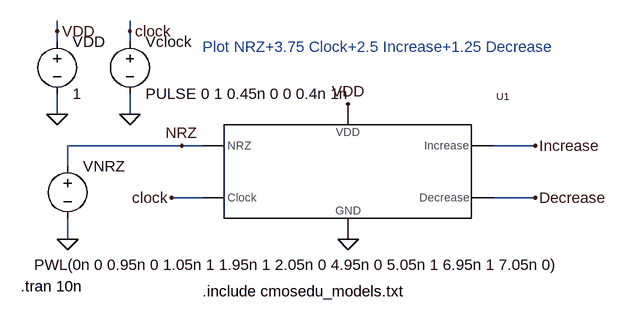
[diagram p0: schematic Fig19_72.asc]
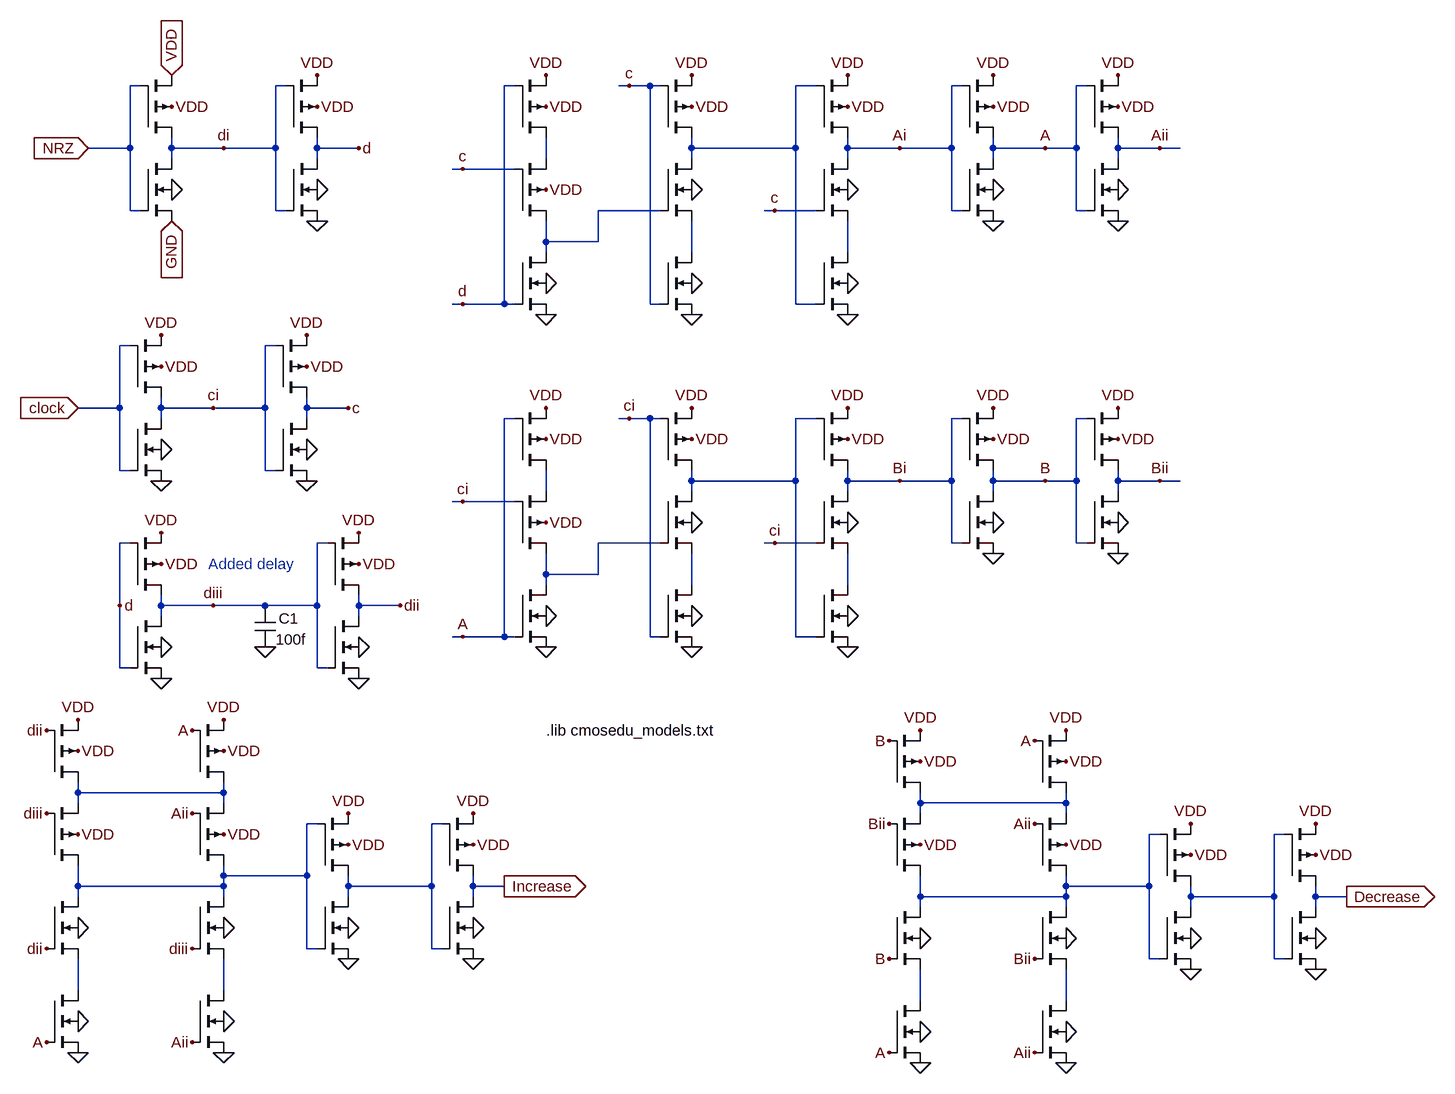
[diagram p1: sub-circuit hogge_pd.asc]
Fig19_72.asc, the LTspice schematic file:
Version 4
SHEET 1 6288 680
WIRE 1168 -1104 1168 -1120
WIRE 1280 -1104 1280 -1120
WIRE 1168 -1088 1168 -1104
WIRE 1280 -1088 1280 -1104
WIRE 1168 -976 1168 -1008
WIRE 1280 -976 1280 -1008
WIRE 1360 -928 1184 -928
WIRE 1392 -928 1360 -928
WIRE 1904 -928 1840 -928
WIRE 1184 -896 1184 -928
WIRE 1392 -848 1344 -848
WIRE 1904 -848 1840 -848
WIRE 1184 -784 1184 -816
FLAG 1168 -976 0
FLAG 1168 -1104 VDD
FLAG 1616 -784 0
FLAG 1616 -992 VDD
FLAG 1344 -848 clock
FLAG 1360 -928 NRZ
FLAG 1904 -928 Increase
FLAG 1904 -848 Decrease
FLAG 1184 -784 0
FLAG 1280 -976 0
FLAG 1280 -1104 clock
SYMBOL voltage 1168 -1104 R0
WINDOW 123 0 0 Left 0
WINDOW 39 0 0 Left 0
SYMATTR InstName VDD
SYMATTR Value 1
SYMBOL voltage 1184 -912 R0
WINDOW 123 0 0 Left 0
WINDOW 39 0 0 Left 0
WINDOW 3 -51 167 Left 0
SYMATTR Value PWL(0n 0 0.95n 0 1.05n 1 1.95n 1 2.05n 0 4.95n 0 5.05n 1 6.95n 1 7.05n 0)
SYMATTR InstName VNRZ
SYMBOL voltage 1280 -1104 R0
WINDOW 123 0 0 Left 0
WINDOW 39 0 0 Left 0
SYMATTR InstName Vclock
SYMATTR Value PULSE 0 1 0.45n 0 0 0.4n 1n
SYMBOL Hogge_PD 1424 -880 R0
SYMATTR InstName U1
TEXT 1112 -712 Left 0 !.tran 10n
TEXT 1392 -1080 Left 0 ;Plot NRZ+3.75 Clock+2.5 Increase+1.25 Decrease
TEXT 1392 -704 Left 0 !.include cmosedu_models.txt

hogge_pd.asc, the sub-circuit schematic file:
Version 4
SHEET 1 6288 1628
WIRE 336 544 336 528
WIRE 336 560 336 544
WIRE 336 688 336 656
WIRE 336 704 336 688
WIRE 336 848 336 800
WIRE 400 -48 336 -48
WIRE 400 -48 400 -144
WIRE 400 48 400 -48
WIRE 400 256 400 160
WIRE 400 352 400 256
WIRE 416 -448 352 -448
WIRE 416 -448 416 -544
WIRE 416 -352 416 -448
WIRE 416 -144 400 -144
WIRE 416 48 400 48
WIRE 416 160 400 160
WIRE 416 352 400 352
WIRE 432 -544 416 -544
WIRE 432 -352 416 -352
WIRE 464 -48 464 -64
WIRE 464 -32 464 -48
WIRE 464 256 464 240
WIRE 464 272 464 256
WIRE 480 -448 480 -464
WIRE 480 -432 480 -448
WIRE 544 -48 464 -48
WIRE 544 256 464 256
WIRE 560 -448 480 -448
WIRE 560 544 336 544
WIRE 560 544 560 528
WIRE 560 560 560 544
WIRE 560 672 560 656
WIRE 560 688 336 688
WIRE 560 688 560 672
WIRE 560 704 560 688
WIRE 560 848 560 800
WIRE 624 -48 544 -48
WIRE 624 -48 624 -144
WIRE 624 48 624 -48
WIRE 624 256 544 256
WIRE 640 -448 560 -448
WIRE 640 -448 640 -544
WIRE 640 -352 640 -448
WIRE 640 -144 624 -144
WIRE 640 48 624 48
WIRE 656 -544 640 -544
WIRE 656 -352 640 -352
WIRE 688 -48 688 -64
WIRE 688 -32 688 -48
WIRE 688 672 560 672
WIRE 688 672 688 592
WIRE 688 784 688 672
WIRE 704 -448 704 -464
WIRE 704 -432 704 -448
WIRE 704 256 624 256
WIRE 704 256 704 160
WIRE 704 352 704 256
WIRE 704 592 688 592
WIRE 704 784 688 784
WIRE 720 160 704 160
WIRE 720 352 704 352
WIRE 752 -48 688 -48
WIRE 752 688 752 672
WIRE 752 704 752 688
WIRE 768 -448 704 -448
WIRE 768 256 768 240
WIRE 768 272 768 256
WIRE 832 256 768 256
WIRE 880 688 752 688
WIRE 880 688 880 592
WIRE 880 784 880 688
WIRE 896 592 880 592
WIRE 896 784 880 784
WIRE 928 -416 912 -416
WIRE 928 -208 912 -208
WIRE 928 96 912 96
WIRE 928 304 912 304
WIRE 944 688 944 672
WIRE 944 704 944 688
WIRE 992 -208 928 -208
WIRE 992 -208 992 -544
WIRE 992 304 928 304
WIRE 992 304 992 -32
WIRE 992 688 944 688
WIRE 1008 -544 992 -544
WIRE 1008 -416 928 -416
WIRE 1008 -208 992 -208
WIRE 1008 -32 992 -32
WIRE 1008 96 928 96
WIRE 1008 304 992 304
WIRE 1056 -432 1056 -464
WIRE 1056 -304 1056 -336
WIRE 1056 -288 1056 -304
WIRE 1056 80 1056 48
WIRE 1056 208 1056 176
WIRE 1056 224 1056 208
WIRE 1136 -304 1056 -304
WIRE 1136 -304 1136 -352
WIRE 1136 208 1056 208
WIRE 1136 208 1136 160
WIRE 1184 -544 1168 -544
WIRE 1184 -32 1168 -32
WIRE 1216 -544 1184 -544
WIRE 1216 -208 1216 -544
WIRE 1216 -32 1184 -32
WIRE 1216 304 1216 -32
WIRE 1232 -544 1216 -544
WIRE 1232 -352 1136 -352
WIRE 1232 -208 1216 -208
WIRE 1232 -32 1216 -32
WIRE 1232 160 1136 160
WIRE 1232 304 1216 304
WIRE 1280 -448 1280 -464
WIRE 1280 -432 1280 -448
WIRE 1280 -288 1280 -336
WIRE 1280 64 1280 48
WIRE 1280 80 1280 64
WIRE 1280 224 1280 176
WIRE 1408 -352 1392 -352
WIRE 1408 160 1392 160
WIRE 1440 -448 1280 -448
WIRE 1440 -448 1440 -544
WIRE 1440 -208 1440 -448
WIRE 1440 64 1280 64
WIRE 1440 64 1440 -32
WIRE 1440 304 1440 64
WIRE 1472 -544 1440 -544
WIRE 1472 -352 1408 -352
WIRE 1472 -208 1440 -208
WIRE 1472 -32 1440 -32
WIRE 1472 160 1408 160
WIRE 1472 304 1440 304
WIRE 1520 -448 1520 -464
WIRE 1520 -432 1520 -448
WIRE 1520 -288 1520 -336
WIRE 1520 64 1520 48
WIRE 1520 80 1520 64
WIRE 1520 224 1520 176
WIRE 1600 -448 1520 -448
WIRE 1600 64 1520 64
WIRE 1632 560 1632 544
WIRE 1632 576 1632 560
WIRE 1632 704 1632 672
WIRE 1632 720 1632 704
WIRE 1632 864 1632 816
WIRE 1680 -448 1600 -448
WIRE 1680 -448 1680 -544
WIRE 1680 -352 1680 -448
WIRE 1680 64 1600 64
WIRE 1680 64 1680 -32
WIRE 1680 160 1680 64
WIRE 1696 -544 1680 -544
WIRE 1696 -352 1680 -352
WIRE 1696 -32 1680 -32
WIRE 1696 160 1680 160
WIRE 1744 -448 1744 -464
WIRE 1744 -432 1744 -448
WIRE 1744 64 1744 48
WIRE 1744 80 1744 64
WIRE 1824 -448 1744 -448
WIRE 1824 64 1744 64
WIRE 1856 560 1632 560
WIRE 1856 560 1856 544
WIRE 1856 576 1856 560
WIRE 1856 688 1856 672
WIRE 1856 704 1632 704
WIRE 1856 704 1856 688
WIRE 1856 720 1856 704
WIRE 1856 864 1856 816
WIRE 1872 -448 1824 -448
WIRE 1872 -448 1872 -544
WIRE 1872 -352 1872 -448
WIRE 1872 64 1824 64
WIRE 1872 64 1872 -32
WIRE 1872 160 1872 64
WIRE 1888 -544 1872 -544
WIRE 1888 -352 1872 -352
WIRE 1888 -32 1872 -32
WIRE 1888 160 1872 160
WIRE 1936 -448 1936 -464
WIRE 1936 -432 1936 -448
WIRE 1936 64 1936 48
WIRE 1936 80 1936 64
WIRE 1984 688 1856 688
WIRE 1984 688 1984 608
WIRE 1984 800 1984 688
WIRE 2000 -448 1936 -448
WIRE 2000 64 1936 64
WIRE 2000 608 1984 608
WIRE 2000 800 1984 800
WIRE 2032 -448 2000 -448
WIRE 2032 64 2000 64
WIRE 2048 704 2048 688
WIRE 2048 720 2048 704
WIRE 2176 704 2048 704
WIRE 2176 704 2176 608
WIRE 2176 800 2176 704
WIRE 2192 608 2176 608
WIRE 2192 800 2176 800
WIRE 2240 704 2240 688
WIRE 2240 720 2240 704
WIRE 2288 704 2240 704
FLAG 480 -512 VDD
FLAG 1280 -384 0
FLAG 704 -512 VDD
FLAG 1056 -512 VDD
FLAG 1280 -512 VDD
FLAG 1520 -512 VDD
FLAG 1744 -512 VDD
FLAG 1936 -512 VDD
FLAG 1056 -384 VDD
FLAG 480 -384 0
FLAG 704 -384 0
FLAG 1520 -384 0
FLAG 1744 -384 0
FLAG 1936 -384 0
FLAG 1056 -240 0
FLAG 1280 -240 0
FLAG 1520 -240 0
FLAG 1632 496 VDD
FLAG 1856 496 VDD
FLAG 1632 624 VDD
FLAG 1856 624 VDD
FLAG 1632 768 0
FLAG 1856 768 0
FLAG 1632 912 0
FLAG 1856 912 0
FLAG 2048 640 VDD
FLAG 2240 640 VDD
FLAG 2048 768 0
FLAG 2240 768 0
FLAG 480 -560 VDD
IOPIN 480 -560 In
FLAG 480 -336 GND
IOPIN 480 -336 In
FLAG 352 -448 NRZ
IOPIN 352 -448 In
FLAG 704 -336 0
FLAG 704 -560 VDD
FLAG 1056 -560 VDD
FLAG 1280 -560 VDD
FLAG 1520 -560 VDD
FLAG 1744 -560 VDD
FLAG 1936 -560 VDD
FLAG 2240 592 VDD
FLAG 2048 592 VDD
FLAG 1856 448 VDD
FLAG 1632 448 VDD
FLAG 560 -448 di
FLAG 768 -448 d
FLAG 1056 -192 0
FLAG 1280 -192 0
FLAG 1520 -192 0
FLAG 1936 -336 0
FLAG 1744 -336 0
FLAG 2240 816 0
FLAG 2048 816 0
FLAG 1856 960 0
FLAG 1632 960 0
FLAG 2288 704 Decrease
IOPIN 2288 704 Out
FLAG 928 -416 c
FLAG 1184 -544 c
FLAG 1408 -352 c
FLAG 928 -208 d
FLAG 1600 -448 Ai
FLAG 1824 -448 A
FLAG 2000 -448 Aii
FLAG 1584 464 B
FLAG 1584 800 B
FLAG 1584 592 Bii
FLAG 1584 944 A
FLAG 1808 944 Aii
FLAG 1808 800 Bii
FLAG 1808 592 Aii
FLAG 1808 464 A
FLAG 464 -112 VDD
FLAG 1280 128 0
FLAG 688 -112 VDD
FLAG 1056 0 VDD
FLAG 1280 0 VDD
FLAG 1520 0 VDD
FLAG 1744 0 VDD
FLAG 1936 0 VDD
FLAG 1056 128 VDD
FLAG 464 16 0
FLAG 688 16 0
FLAG 1520 128 0
FLAG 1744 128 0
FLAG 1936 128 0
FLAG 1056 272 0
FLAG 1280 272 0
FLAG 1520 272 0
FLAG 336 480 VDD
FLAG 560 480 VDD
FLAG 336 608 VDD
FLAG 560 608 VDD
FLAG 336 752 0
FLAG 560 752 0
FLAG 336 896 0
FLAG 560 896 0
FLAG 752 624 VDD
FLAG 944 624 VDD
FLAG 752 752 0
FLAG 944 752 0
FLAG 336 -48 clock
IOPIN 336 -48 In
FLAG 688 64 0
FLAG 688 -160 VDD
FLAG 1056 -48 VDD
FLAG 1280 -48 VDD
FLAG 1520 -48 VDD
FLAG 1744 -48 VDD
FLAG 1936 -48 VDD
FLAG 944 576 VDD
FLAG 752 576 VDD
FLAG 560 432 VDD
FLAG 336 432 VDD
FLAG 544 -48 ci
FLAG 752 -48 c
FLAG 1056 320 0
FLAG 1280 320 0
FLAG 1520 320 0
FLAG 1936 176 0
FLAG 1744 176 0
FLAG 944 800 0
FLAG 752 800 0
FLAG 560 944 0
FLAG 336 944 0
FLAG 992 688 Increase
IOPIN 992 688 Out
FLAG 928 96 ci
FLAG 1184 -32 ci
FLAG 1408 160 ci
FLAG 928 304 A
FLAG 1600 64 Bi
FLAG 1824 64 B
FLAG 2000 64 Bii
FLAG 288 448 dii
FLAG 288 784 dii
FLAG 288 576 diii
FLAG 288 928 A
FLAG 512 928 Aii
FLAG 512 784 diii
FLAG 512 576 Aii
FLAG 512 448 A
FLAG 464 64 0
FLAG 464 -160 VDD
FLAG 464 192 VDD
FLAG 768 192 VDD
FLAG 464 320 0
FLAG 768 320 0
FLAG 768 368 0
FLAG 768 144 VDD
FLAG 544 256 diii
FLAG 832 256 dii
FLAG 464 368 0
FLAG 464 144 VDD
FLAG 400 256 d
FLAG 624 320 0
SYMBOL pmos4 432 -464 M180
WINDOW 0 88 9 Invisible 0
WINDOW 3 168 20 Invisible 0
SYMATTR InstName M3
SYMATTR Value P_50n
SYMATTR Value2 l=50n w=1u
SYMBOL nmos4 1232 -432 R0
WINDOW 0 104 24 Invisible 0
WINDOW 3 179 41 Invisible 0
SYMATTR InstName M7
SYMATTR Value N_50n
SYMATTR Value2 l=50n w=500n
SYMBOL pmos4 656 -464 M180
WINDOW 0 88 9 Invisible 0
WINDOW 3 168 20 Invisible 0
SYMATTR InstName M1
SYMATTR Value P_50n
SYMATTR Value2 l=50n w=1u
SYMBOL pmos4 1008 -464 M180
WINDOW 0 88 9 Invisible 0
WINDOW 3 168 20 Invisible 0
SYMATTR InstName M2
SYMATTR Value P_50n
SYMATTR Value2 l=50n w=1u
SYMBOL pmos4 1232 -464 M180
WINDOW 0 88 9 Invisible 0
WINDOW 3 168 20 Invisible 0
SYMATTR InstName M4
SYMATTR Value P_50n
SYMATTR Value2 l=50n w=1u
SYMBOL pmos4 1472 -464 M180
WINDOW 0 88 9 Invisible 0
WINDOW 3 168 20 Invisible 0
SYMATTR InstName M5
SYMATTR Value P_50n
SYMATTR Value2 l=50n w=1u
SYMBOL pmos4 1696 -464 M180
WINDOW 0 88 9 Invisible 0
WINDOW 3 168 20 Invisible 0
SYMATTR InstName M6
SYMATTR Value P_50n
SYMATTR Value2 l=50n w=1u
SYMBOL pmos4 1888 -464 M180
WINDOW 0 88 9 Invisible 0
WINDOW 3 168 20 Invisible 0
SYMATTR InstName M8
SYMATTR Value P_50n
SYMATTR Value2 l=50n w=1u
SYMBOL pmos4 1008 -336 M180
WINDOW 0 88 9 Invisible 0
WINDOW 3 168 20 Invisible 0
SYMATTR InstName M9
SYMATTR Value P_50n
SYMATTR Value2 l=50n w=1u
SYMBOL nmos4 432 -432 R0
WINDOW 0 104 24 Invisible 0
WINDOW 3 179 41 Invisible 0
SYMATTR InstName M10
SYMATTR Value N_50n
SYMATTR Value2 l=50n w=500n
SYMBOL nmos4 656 -432 R0
WINDOW 0 104 24 Invisible 0
WINDOW 3 179 41 Invisible 0
SYMATTR InstName M11
SYMATTR Value N_50n
SYMATTR Value2 l=50n w=500n
SYMBOL nmos4 1472 -432 R0
WINDOW 0 104 24 Invisible 0
WINDOW 3 179 41 Invisible 0
SYMATTR InstName M12
SYMATTR Value N_50n
SYMATTR Value2 l=50n w=500n
SYMBOL nmos4 1696 -432 R0
WINDOW 0 104 24 Invisible 0
WINDOW 3 179 41 Invisible 0
SYMATTR InstName M13
SYMATTR Value N_50n
SYMATTR Value2 l=50n w=500n
SYMBOL nmos4 1888 -432 R0
WINDOW 0 104 24 Invisible 0
WINDOW 3 179 41 Invisible 0
SYMATTR InstName M14
SYMATTR Value N_50n
SYMATTR Value2 l=50n w=500n
SYMBOL nmos4 1008 -288 R0
WINDOW 0 104 24 Invisible 0
WINDOW 3 179 41 Invisible 0
SYMATTR InstName M15
SYMATTR Value N_50n
SYMATTR Value2 l=50n w=500n
SYMBOL nmos4 1232 -288 R0
WINDOW 0 104 24 Invisible 0
WINDOW 3 179 41 Invisible 0
SYMATTR InstName M16
SYMATTR Value N_50n
SYMATTR Value2 l=50n w=500n
SYMBOL nmos4 1472 -288 R0
WINDOW 0 104 24 Invisible 0
WINDOW 3 179 41 Invisible 0
SYMATTR InstName M17
SYMATTR Value N_50n
SYMATTR Value2 l=50n w=500n
SYMBOL pmos4 1584 544 M180
WINDOW 0 88 9 Invisible 0
WINDOW 3 168 20 Invisible 0
SYMATTR InstName M18
SYMATTR Value P_50n
SYMATTR Value2 l=50n w=1u
SYMBOL pmos4 1808 544 M180
WINDOW 0 88 9 Invisible 0
WINDOW 3 168 20 Invisible 0
SYMATTR InstName M19
SYMATTR Value P_50n
SYMATTR Value2 l=50n w=1u
SYMBOL pmos4 1584 672 M180
WINDOW 0 88 9 Invisible 0
WINDOW 3 168 20 Invisible 0
SYMATTR InstName M20
SYMATTR Value P_50n
SYMATTR Value2 l=50n w=1u
SYMBOL pmos4 1808 672 M180
WINDOW 0 88 9 Invisible 0
WINDOW 3 168 20 Invisible 0
SYMATTR InstName M21
SYMATTR Value P_50n
SYMATTR Value2 l=50n w=1u
SYMBOL nmos4 1584 720 R0
WINDOW 0 104 24 Invisible 0
WINDOW 3 179 41 Invisible 0
SYMATTR InstName M22
SYMATTR Value N_50n
SYMATTR Value2 l=50n w=500n
SYMBOL nmos4 1808 720 R0
WINDOW 0 104 24 Invisible 0
WINDOW 3 179 41 Invisible 0
SYMATTR InstName M23
SYMATTR Value N_50n
SYMATTR Value2 l=50n w=500n
SYMBOL nmos4 1584 864 R0
WINDOW 0 104 24 Invisible 0
WINDOW 3 179 41 Invisible 0
SYMATTR InstName M24
SYMATTR Value N_50n
SYMATTR Value2 l=50n w=500n
SYMBOL nmos4 1808 864 R0
WINDOW 0 104 24 Invisible 0
WINDOW 3 179 41 Invisible 0
SYMATTR InstName M25
SYMATTR Value N_50n
SYMATTR Value2 l=50n w=500n
SYMBOL pmos4 2000 688 M180
WINDOW 0 88 9 Invisible 0
WINDOW 3 168 20 Invisible 0
SYMATTR InstName M26
SYMATTR Value P_50n
SYMATTR Value2 l=50n w=1u
SYMBOL pmos4 2192 688 M180
WINDOW 0 88 9 Invisible 0
WINDOW 3 168 20 Invisible 0
SYMATTR InstName M27
SYMATTR Value P_50n
SYMATTR Value2 l=50n w=1u
SYMBOL nmos4 2000 720 R0
WINDOW 0 104 24 Invisible 0
WINDOW 3 179 41 Invisible 0
SYMATTR InstName M28
SYMATTR Value N_50n
SYMATTR Value2 l=50n w=500n
SYMBOL nmos4 2192 720 R0
WINDOW 0 104 24 Invisible 0
WINDOW 3 179 41 Invisible 0
SYMATTR InstName M29
SYMATTR Value N_50n
SYMATTR Value2 l=50n w=500n
SYMBOL pmos4 416 -64 M180
WINDOW 0 88 9 Invisible 0
WINDOW 3 168 20 Invisible 0
SYMATTR InstName M30
SYMATTR Value P_50n
SYMATTR Value2 l=50n w=1u
SYMBOL nmos4 1232 80 R0
WINDOW 0 104 24 Invisible 0
WINDOW 3 179 41 Invisible 0
SYMATTR InstName M31
SYMATTR Value N_50n
SYMATTR Value2 l=50n w=500n
SYMBOL pmos4 640 -64 M180
WINDOW 0 88 9 Invisible 0
WINDOW 3 168 20 Invisible 0
SYMATTR InstName M32
SYMATTR Value P_50n
SYMATTR Value2 l=50n w=1u
SYMBOL pmos4 1008 48 M180
WINDOW 0 88 9 Invisible 0
WINDOW 3 168 20 Invisible 0
SYMATTR InstName M33
SYMATTR Value P_50n
SYMATTR Value2 l=50n w=1u
SYMBOL pmos4 1232 48 M180
WINDOW 0 88 9 Invisible 0
WINDOW 3 168 20 Invisible 0
SYMATTR InstName M34
SYMATTR Value P_50n
SYMATTR Value2 l=50n w=1u
SYMBOL pmos4 1472 48 M180
WINDOW 0 88 9 Invisible 0
WINDOW 3 168 20 Invisible 0
SYMATTR InstName M35
SYMATTR Value P_50n
SYMATTR Value2 l=50n w=1u
SYMBOL pmos4 1696 48 M180
WINDOW 0 88 9 Invisible 0
WINDOW 3 168 20 Invisible 0
SYMATTR InstName M36
SYMATTR Value P_50n
SYMATTR Value2 l=50n w=1u
SYMBOL pmos4 1888 48 M180
WINDOW 0 88 9 Invisible 0
WINDOW 3 168 20 Invisible 0
SYMATTR InstName M37
SYMATTR Value P_50n
SYMATTR Value2 l=50n w=1u
SYMBOL pmos4 1008 176 M180
WINDOW 0 88 9 Invisible 0
WINDOW 3 168 20 Invisible 0
SYMATTR InstName M38
SYMATTR Value P_50n
SYMATTR Value2 l=50n w=1u
SYMBOL nmos4 416 -32 R0
WINDOW 0 104 24 Invisible 0
WINDOW 3 179 41 Invisible 0
SYMATTR InstName M39
SYMATTR Value N_50n
SYMATTR Value2 l=50n w=500n
SYMBOL nmos4 640 -32 R0
WINDOW 0 104 24 Invisible 0
WINDOW 3 179 41 Invisible 0
SYMATTR InstName M40
SYMATTR Value N_50n
SYMATTR Value2 l=50n w=500n
SYMBOL nmos4 1472 80 R0
WINDOW 0 104 24 Invisible 0
WINDOW 3 179 41 Invisible 0
SYMATTR InstName M41
SYMATTR Value N_50n
SYMATTR Value2 l=50n w=500n
SYMBOL nmos4 1696 80 R0
WINDOW 0 104 24 Invisible 0
WINDOW 3 179 41 Invisible 0
SYMATTR InstName M42
SYMATTR Value N_50n
SYMATTR Value2 l=50n w=500n
SYMBOL nmos4 1888 80 R0
WINDOW 0 104 24 Invisible 0
WINDOW 3 179 41 Invisible 0
SYMATTR InstName M43
SYMATTR Value N_50n
SYMATTR Value2 l=50n w=500n
SYMBOL nmos4 1008 224 R0
WINDOW 0 104 24 Invisible 0
WINDOW 3 179 41 Invisible 0
SYMATTR InstName M44
SYMATTR Value N_50n
SYMATTR Value2 l=50n w=500n
SYMBOL nmos4 1232 224 R0
WINDOW 0 104 24 Invisible 0
WINDOW 3 179 41 Invisible 0
SYMATTR InstName M45
SYMATTR Value N_50n
SYMATTR Value2 l=50n w=500n
SYMBOL nmos4 1472 224 R0
WINDOW 0 104 24 Invisible 0
WINDOW 3 179 41 Invisible 0
SYMATTR InstName M46
SYMATTR Value N_50n
SYMATTR Value2 l=50n w=500n
SYMBOL pmos4 288 528 M180
WINDOW 0 88 9 Invisible 0
WINDOW 3 168 20 Invisible 0
SYMATTR InstName M47
SYMATTR Value P_50n
SYMATTR Value2 l=50n w=1u
SYMBOL pmos4 512 528 M180
WINDOW 0 88 9 Invisible 0
WINDOW 3 168 20 Invisible 0
SYMATTR InstName M48
SYMATTR Value P_50n
SYMATTR Value2 l=50n w=1u
SYMBOL pmos4 288 656 M180
WINDOW 0 88 9 Invisible 0
WINDOW 3 168 20 Invisible 0
SYMATTR InstName M49
SYMATTR Value P_50n
SYMATTR Value2 l=50n w=1u
SYMBOL pmos4 512 656 M180
WINDOW 0 88 9 Invisible 0
WINDOW 3 168 20 Invisible 0
SYMATTR InstName M50
SYMATTR Value P_50n
SYMATTR Value2 l=50n w=1u
SYMBOL nmos4 288 704 R0
WINDOW 0 104 24 Invisible 0
WINDOW 3 179 41 Invisible 0
SYMATTR InstName M51
SYMATTR Value N_50n
SYMATTR Value2 l=50n w=500n
SYMBOL nmos4 512 704 R0
WINDOW 0 104 24 Invisible 0
WINDOW 3 179 41 Invisible 0
SYMATTR InstName M52
SYMATTR Value N_50n
SYMATTR Value2 l=50n w=500n
SYMBOL nmos4 288 848 R0
WINDOW 0 104 24 Invisible 0
WINDOW 3 179 41 Invisible 0
SYMATTR InstName M53
SYMATTR Value N_50n
SYMATTR Value2 l=50n w=500n
SYMBOL nmos4 512 848 R0
WINDOW 0 104 24 Invisible 0
WINDOW 3 179 41 Invisible 0
SYMATTR InstName M54
SYMATTR Value N_50n
SYMATTR Value2 l=50n w=500n
SYMBOL pmos4 704 672 M180
WINDOW 0 88 9 Invisible 0
WINDOW 3 168 20 Invisible 0
SYMATTR InstName M55
SYMATTR Value P_50n
SYMATTR Value2 l=50n w=1u
SYMBOL pmos4 896 672 M180
WINDOW 0 88 9 Invisible 0
WINDOW 3 168 20 Invisible 0
SYMATTR InstName M56
SYMATTR Value P_50n
SYMATTR Value2 l=50n w=1u
SYMBOL nmos4 704 704 R0
WINDOW 0 104 24 Invisible 0
WINDOW 3 179 41 Invisible 0
SYMATTR InstName M57
SYMATTR Value N_50n
SYMATTR Value2 l=50n w=500n
SYMBOL nmos4 896 704 R0
WINDOW 0 104 24 Invisible 0
WINDOW 3 179 41 Invisible 0
SYMATTR InstName M58
SYMATTR Value N_50n
SYMATTR Value2 l=50n w=500n
SYMBOL pmos4 416 240 M180
WINDOW 0 88 9 Invisible 0
WINDOW 3 168 20 Invisible 0
SYMATTR InstName M59
SYMATTR Value P_50n
SYMATTR Value2 l=50n w=1u
SYMBOL pmos4 720 240 M180
WINDOW 0 88 9 Invisible 0
WINDOW 3 168 20 Invisible 0
SYMATTR InstName M60
SYMATTR Value P_50n
SYMATTR Value2 l=50n w=1u
SYMBOL nmos4 416 272 R0
WINDOW 0 104 24 Invisible 0
WINDOW 3 179 41 Invisible 0
SYMATTR InstName M61
SYMATTR Value N_50n
SYMATTR Value2 l=50n w=500n
SYMBOL nmos4 720 272 R0
WINDOW 0 104 24 Invisible 0
WINDOW 3 179 41 Invisible 0
SYMATTR InstName M62
SYMATTR Value N_50n
SYMATTR Value2 l=50n w=500n
SYMBOL cap 608 256 R0
WINDOW 0 37 20 Left 0
WINDOW 3 32 52 Left 0
SYMATTR InstName C1
SYMATTR Value 100f
TEXT 536 192 Left 0 ;Added delay
TEXT 1056 448 Left 0 !.lib cmosedu_models.txt

The netlist it stands for:
* Fig19_72.asc
VDD VDD 0 1
VNRZ NRZ 0 PWL(0n 0 0.95n 0 1.05n 1 1.95n 1 2.05n 0 4.95n 0 5.05n 1 6.95n 1 7.05n 0)
Vclock clock 0 PULSE 0 1 0.45n 0 0 0.4n 1n
XU1 NRZ clock Increase Decrease VDD 0 hogge_pd

* block symbol definitions
.subckt hogge_pd NRZ Clock Increase Decrease VDD GND
M3 di NRZ VDD VDD P_50n l=50n w=1u
M7 N010 N007 N011 0 N_50n l=50n w=500n
M1 d di VDD VDD P_50n l=50n w=1u
M2 N006 d VDD VDD P_50n l=50n w=1u
M4 N010 c VDD VDD P_50n l=50n w=1u
M5 Ai N010 VDD VDD P_50n l=50n w=1u
M6 A Ai VDD VDD P_50n l=50n w=1u
M8 Aii A VDD VDD P_50n l=50n w=1u
M9 N007 c N006 VDD P_50n l=50n w=1u
M10 di NRZ GND 0 N_50n l=50n w=500n
M11 d di 0 0 N_50n l=50n w=500n
M12 Ai c N014 0 N_50n l=50n w=500n
M13 A Ai 0 0 N_50n l=50n w=500n
M14 Aii A 0 0 N_50n l=50n w=500n
M15 N007 d 0 0 N_50n l=50n w=500n
M16 N011 c 0 0 N_50n l=50n w=500n
M17 N014 N010 0 0 N_50n l=50n w=500n
M18 N016 B VDD VDD P_50n l=50n w=1u
M19 N016 A VDD VDD P_50n l=50n w=1u
M20 N017 Bii N016 VDD P_50n l=50n w=1u
M21 N017 Aii N016 VDD P_50n l=50n w=1u
M22 N017 B N018 0 N_50n l=50n w=500n
M23 N017 Bii N019 0 N_50n l=50n w=500n
M24 N018 A 0 0 N_50n l=50n w=500n
M25 N019 Aii 0 0 N_50n l=50n w=500n
M26 N020 N017 VDD VDD P_50n l=50n w=1u
M27 Decrease N020 VDD VDD P_50n l=50n w=1u
M28 N020 N017 0 0 N_50n l=50n w=500n
M29 Decrease N020 0 0 N_50n l=50n w=500n
M30 ci clock VDD VDD P_50n l=50n w=1u
M31 N012 N009 N013 0 N_50n l=50n w=500n
M32 c ci VDD VDD P_50n l=50n w=1u
M33 N008 A VDD VDD P_50n l=50n w=1u
M34 N012 ci VDD VDD P_50n l=50n w=1u
M35 Bi N012 VDD VDD P_50n l=50n w=1u
M36 B Bi VDD VDD P_50n l=50n w=1u
M37 Bii B VDD VDD P_50n l=50n w=1u
M38 N009 ci N008 VDD P_50n l=50n w=1u
M39 ci clock 0 0 N_50n l=50n w=500n
M40 c ci 0 0 N_50n l=50n w=500n
M41 Bi ci N015 0 N_50n l=50n w=500n
M42 B Bi 0 0 N_50n l=50n w=500n
M43 Bii B 0 0 N_50n l=50n w=500n
M44 N009 A 0 0 N_50n l=50n w=500n
M45 N013 ci 0 0 N_50n l=50n w=500n
M46 N015 N012 0 0 N_50n l=50n w=500n
M47 N001 dii VDD VDD P_50n l=50n w=1u
M48 N001 A VDD VDD P_50n l=50n w=1u
M49 N002 diii N001 VDD P_50n l=50n w=1u
M50 N002 Aii N001 VDD P_50n l=50n w=1u
M51 N002 dii N003 0 N_50n l=50n w=500n
M52 N002 diii N004 0 N_50n l=50n w=500n
M53 N003 A 0 0 N_50n l=50n w=500n
M54 N004 Aii 0 0 N_50n l=50n w=500n
M55 N005 N002 VDD VDD P_50n l=50n w=1u
M56 Increase N005 VDD VDD P_50n l=50n w=1u
M57 N005 N002 0 0 N_50n l=50n w=500n
M58 Increase N005 0 0 N_50n l=50n w=500n
M59 diii d VDD VDD P_50n l=50n w=1u
M60 dii diii VDD VDD P_50n l=50n w=1u
M61 diii d 0 0 N_50n l=50n w=500n
M62 dii diii 0 0 N_50n l=50n w=500n
C1 diii 0 100f
* Added delay
.lib cmosedu_models.txt
.ends hogge_pd

.model NMOS NMOS
.model PMOS PMOS
.lib standard.mos
.tran 10n
* Plot NRZ+3.75 Clock+2.5 Increase+1.25 Decrease
.include cmosedu_models.txt
.backanno
.end